# EAGLE design Hall Effect Surface Mount (no AH9251) (EAGLE 7.1.0)
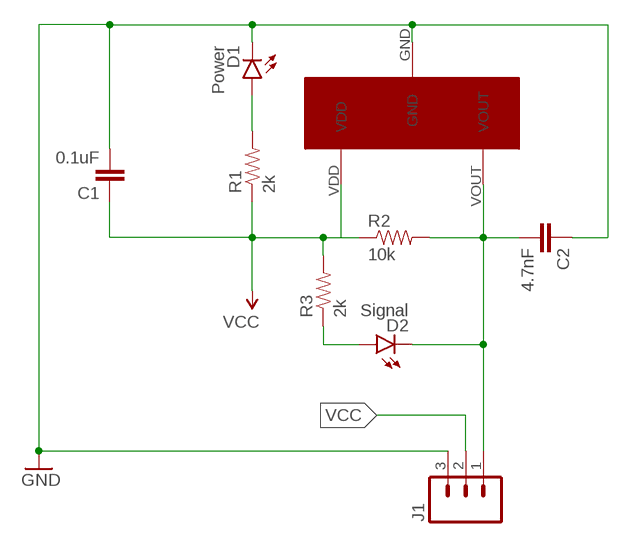
[diagram p0: schematic, sheet 1]

## Parts
C1  0.1uF  CAP0603-CAP  [0603-CAP]
C2  4.7nF  CAP0603-CAP  [0603-CAP]
D1  Power  LED0603  [LED-0603]
D2  Signal  LED0603  [LED-0603]
J1  M03PTH  [1X03]
R1  2k  RESISTOR0603-RES  [0603-RES]
R2  10k  RESISTOR0603-RES  [0603-RES]
R3  2k  RESISTOR0603-RES  [0603-RES]
U$1  US5881-HALL-EFFECT  [US5881-HALL-EFFECT]

## Nets
GND: C1.2 C2.1 D1.C J1.3 U$1.GND
N$1: D1.A R1.2
N$2: D2.A R3.1
N$3: C2.2 D2.C J1.1 R2.2 U$1.VOUT
VCC: C1.1 J1.2 R1.1 R2.1 R3.2 U$1.VDD

## Library data of the parts
C1 C2 = SparkFun-Passives:CAP: Capacitor Standard 0603 ceramic capacitor, and 0.1" leaded capacitor.
D1 D2 = SparkFun-LED:LED: LEDs Standard schematic elements and footprints for 5mm, 3mm, 1206, and 0603 sized LEDs. 5mm - Spark Fun Electronics SKU : COM-00529 (and others)
J1 = SparkFun-Connectors:M03: Header 3 Standard 3-pin 0.1" header. Use with straight break away headers (SKU : PRT-00116), right angle break away headers (PRT-00553), swiss pins (PRT-00743), machine pins (PRT-00117), and female headers (PRT-00115). Molex polarized connector foot print use with SKU : PRT-08232 with associated crimp pins and housings.
R1-R3 = SparkFun-Passives:RESISTOR: Resistor Basic schematic elements and footprints for 0603, 1206, and PTH resistors.
U$1 = TPS5430:US5881-HALL-EFFECT

## Board
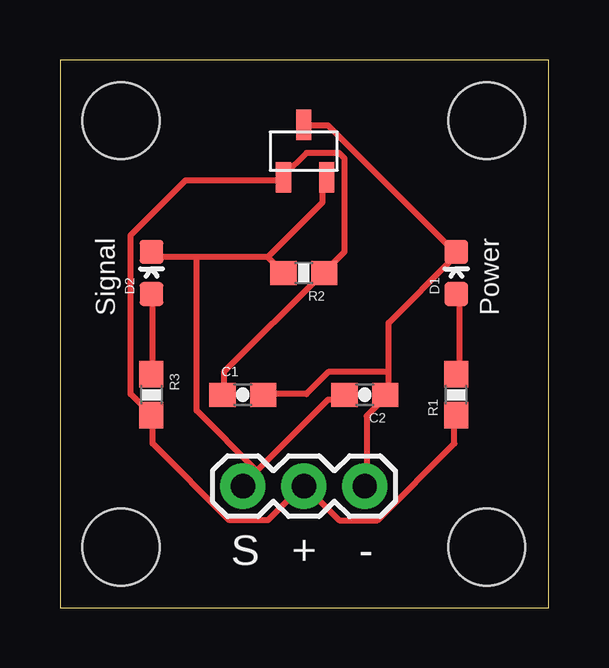
[diagram p1: board, top side]

Size 20.37 x 22.85 mm. Coordinates in mm from the lower left corner, seen from the top.
Outline: 0,0 20.37,0 20.37,22.85 0,22.85 0,0
Copper layers (1*16): Top 0.035mm / dielectric 1.5mm / Bottom 0.035mm
Design rules "default": minimum track width 10mil, minimum drill 24mil, track to track 8mil, track to pad 8mil, pad to pad 8mil, via to via 8mil, smd to smd 8mil, copper to edge 40mil, drill to drill 8mil, minimum pad ring 10mil, minimum via ring 8mil, stop-mask expansion 4mil, vias tented up to drill 0mil, thermal gap 10mil
Holes 3.2 mm at 2.54,20.32 17.78,20.32 2.54,2.54 17.78,2.54

### Footprints (pad centres in the part's own frame; a part is rotated, then mirrored left to right if it is on the bottom)
0603-CAP = smd 1.1 x 1: 1 -0.85,0; 2 0.85,0
LED-0603 = smd 1 x 1: A 0,-0.877; C 0,0.877
1X03 = drill 1.016 pad 1.88: 1 0,0; 2 2.54,0; 3 5.08,0
0603-RES = smd 1.1 x 1: 1 -0.85,0; 2 0.85,0
US5881-HALL-EFFECT = smd 0.635 x 1.27: GND 0,1.1; VDD -0.85,-1.1; VOUT 0.95,-1.1

### Placement (x,y rotation side)
C1  7.62,8.89 0 top
C2  12.7,8.89 180 top
D1  16.51,13.97 0 top
D2  3.81,13.97 0 top
J1  7.62,5.08 0 top
R1  16.51,8.89 90 top
R2  10.16,13.97 180 top
R3  3.81,8.89 270 top
U$1  10.16,19.05 0 top

### Tracks (layer width: path | path; a pad name or v marks a point on that pad's centre or on a via)
GND
  Top 0.254: 13.69,9.83 13.69,8.91 C2.1 13.46,8.69 12.78,8 12.78,5.26 J1.3 | 13.69,9.83 13.69,11.89 16.43,14.63 D1.C 16.43,14.86 11.18,20.12 10.26,20.12 U$1.GND | 13.69,9.83 11.18,9.83 10.26,8.91 8.66,8.91 C1.2
N$1
  Top 0.254: D1.A 16.66,13.03 16.66,9.83 R1.2
N$2
  Top 0.254: D2.A 3.86,13.03 3.86,9.83 R3.1
N$3
  Top 0.254: 8.66,14.63 5.69,14.63 | 5.69,14.63 3.86,14.63 D2.C | 8.66,14.63 9.12,14.17 R2.2 | 8.66,14.63 10.95,16.92 10.95,17.83 U$1.VOUT | 8.2,5.71 7.75,5.26 J1.1 8.2,5.71 | 8.2,5.71 11.18,8.69 11.63,8.69 C2.2 | 5.69,14.63 5.69,8.23 8.2,5.71
VCC
  Top 0.254: C1.1 6.83,8.91 6.83,9.83 10.95,13.95 R2.1 11.18,14.17 11.86,14.86 11.86,18.75 11.63,18.97 10.26,18.97 9.35,18.06 U$1.VDD 9.12,17.83 5.23,17.83 2.95,15.54 2.95,8.91 3.63,8.23 R3.2 3.86,8 3.86,6.86 7.06,3.66 8.66,3.66 10.03,5.03 J1.2 10.26,5.03 11.63,3.66 13.23,3.66 16.43,6.86 16.43,8 R1.1

### Text on the board
tPlace: Signal | Power | S | + | -